# Altium schematic sheet main.SchDoc
size 209 x 297 mm; Address1: Address1; Address2: Address2; Address3: Address3; Address4: Address4; SheetNumber: 1; SheetTotal: 1; Scale: 1:1; Разраб.: М. Карг; Обозначение документа: epm3128.001 Э3; Пров.: макет; Утв.: ---; Номер листа: 1; Общее количество листов: 1; Наименование организации: Алгоритм; Перв. применение: epm.001; Наименование изделия 1: epm3128 extension; Наименование изделия 2: Схема электрическая; Наименование изделия 3: принципиальная; Нач. отд.: Нач. отд.; Фамилия нач. отд.: ---
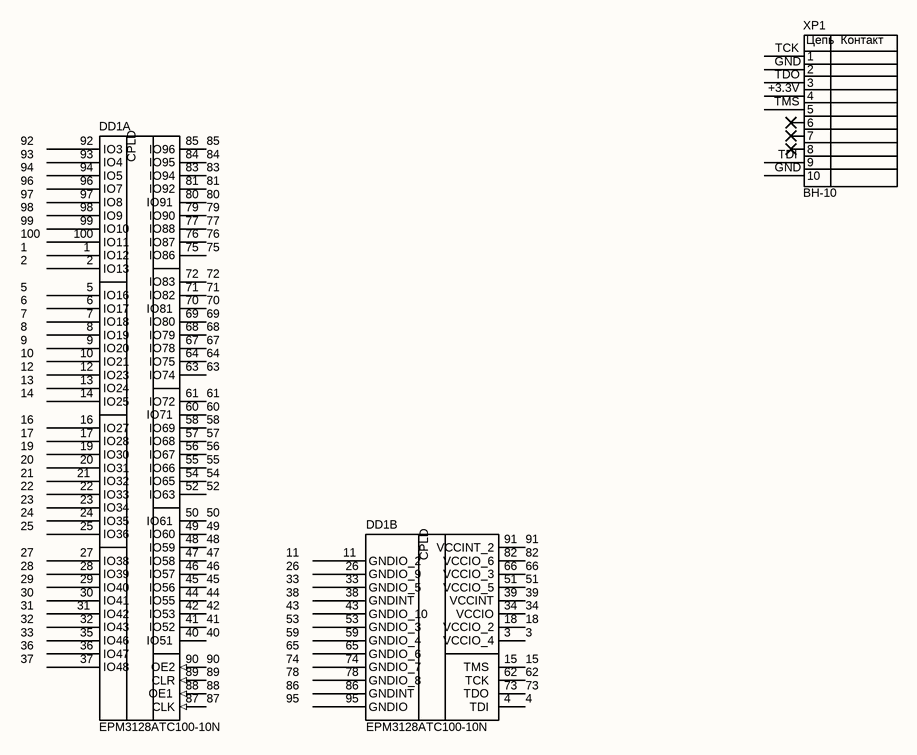
[diagram p0: main.SchDoc]

## Parts
(Parts that share a designator on the sheet are numbered #1, #2 ... from top to bottom, then left to right.)
1  onepin  [onepin]  (value not drawn)  (no BOM)
2  onepin  [onepin]  (value not drawn)  (no BOM)
3  onepin  [onepin]  (value not drawn)  (no BOM)
4  onepin  [onepin]  (value not drawn)  (no BOM)
5  onepin  [onepin]  (value not drawn)  (no BOM)
6  onepin  [onepin]  (value not drawn)  (no BOM)
7  onepin  [onepin]  (value not drawn)  (no BOM)
8  onepin  [onepin]  (value not drawn)  (no BOM)
9  onepin  [onepin]  (value not drawn)  (no BOM)
10  onepin  [onepin]  (value not drawn)  (no BOM)
11  onepin  [onepin]  (value not drawn)  (no BOM)
12  onepin  [onepin]  (value not drawn)  (no BOM)
13  onepin  [onepin]  (value not drawn)  (no BOM)
14  onepin  [onepin]  (value not drawn)  (no BOM)
15  onepin  [onepin]  (value not drawn)  (no BOM)
16  onepin  [onepin]  (value not drawn)  (no BOM)
17  onepin  [onepin]  (value not drawn)  (no BOM)
18  onepin  [onepin]  (value not drawn)  (no BOM)
19  onepin  [onepin]  (value not drawn)  (no BOM)
20  onepin  [onepin]  (value not drawn)  (no BOM)
21  onepin  [onepin]  (value not drawn)  (no BOM)
22  onepin  [onepin]  (value not drawn)  (no BOM)
23  onepin  [onepin]  (value not drawn)  (no BOM)
24  onepin  [onepin]  (value not drawn)  (no BOM)
25  onepin  [onepin]  (value not drawn)  (no BOM)
26  onepin  [onepin]  (value not drawn)  (no BOM)
27  onepin  [onepin]  (value not drawn)  (no BOM)
28  onepin  [onepin]  (value not drawn)  (no BOM)
29  onepin  [onepin]  (value not drawn)  (no BOM)
30  onepin  [onepin]  (value not drawn)  (no BOM)
31  onepin  [onepin]  (value not drawn)  (no BOM)
32  onepin  [onepin]  (value not drawn)  (no BOM)
33#1  onepin  [onepin]  (value not drawn)  (no BOM)
33#2  onepin  [onepin]  (value not drawn)  (no BOM)
34  onepin  [onepin]  (value not drawn)  (no BOM)
36  onepin  [onepin]  (value not drawn)  (no BOM)
37  onepin  [onepin]  (value not drawn)  (no BOM)
38  onepin  [onepin]  (value not drawn)  (no BOM)
39  onepin  [onepin]  (value not drawn)  (no BOM)
40  onepin  [onepin]  (value not drawn)  (no BOM)
41  onepin  [onepin]  (value not drawn)  (no BOM)
42  onepin  [onepin]  (value not drawn)  (no BOM)
43  onepin  [onepin]  (value not drawn)  (no BOM)
44  onepin  [onepin]  (value not drawn)  (no BOM)
45  onepin  [onepin]  (value not drawn)  (no BOM)
46  onepin  [onepin]  (value not drawn)  (no BOM)
47  onepin  [onepin]  (value not drawn)  (no BOM)
48  onepin  [onepin]  (value not drawn)  (no BOM)
49  onepin  [onepin]  (value not drawn)  (no BOM)
50  onepin  [onepin]  (value not drawn)  (no BOM)
51  onepin  [onepin]  (value not drawn)  (no BOM)
52  onepin  [onepin]  (value not drawn)  (no BOM)
53  onepin  [onepin]  (value not drawn)  (no BOM)
54  onepin  [onepin]  (value not drawn)  (no BOM)
55  onepin  [onepin]  (value not drawn)  (no BOM)
56  onepin  [onepin]  (value not drawn)  (no BOM)
57  onepin  [onepin]  (value not drawn)  (no BOM)
58  onepin  [onepin]  (value not drawn)  (no BOM)
59  onepin  [onepin]  (value not drawn)  (no BOM)
60  onepin  [onepin]  (value not drawn)  (no BOM)
61  onepin  [onepin]  (value not drawn)  (no BOM)
62  onepin  [onepin]  (value not drawn)  (no BOM)
63  onepin  [onepin]  (value not drawn)  (no BOM)
64  onepin  [onepin]  (value not drawn)  (no BOM)
65  onepin  [onepin]  (value not drawn)  (no BOM)
66  onepin  [onepin]  (value not drawn)  (no BOM)
67  onepin  [onepin]  (value not drawn)  (no BOM)
68  onepin  [onepin]  (value not drawn)  (no BOM)
69  onepin  [onepin]  (value not drawn)  (no BOM)
70  onepin  [onepin]  (value not drawn)  (no BOM)
71  onepin  [onepin]  (value not drawn)  (no BOM)
72  onepin  [onepin]  (value not drawn)  (no BOM)
73  onepin  [onepin]  (value not drawn)  (no BOM)
74  onepin  [onepin]  (value not drawn)  (no BOM)
75  onepin  [onepin]  (value not drawn)  (no BOM)
76  onepin  [onepin]  (value not drawn)  (no BOM)
77  onepin  [onepin]  (value not drawn)  (no BOM)
78  onepin  [onepin]  (value not drawn)  (no BOM)
79  onepin  [onepin]  (value not drawn)  (no BOM)
80  onepin  [onepin]  (value not drawn)  (no BOM)
81  onepin  [onepin]  (value not drawn)  (no BOM)
82  onepin  [onepin]  (value not drawn)  (no BOM)
83  onepin  [onepin]  (value not drawn)  (no BOM)
84  onepin  [onepin]  (value not drawn)  (no BOM)
85  onepin  [onepin]  (value not drawn)  (no BOM)
86  onepin  [onepin]  (value not drawn)  (no BOM)
87  onepin  [onepin]  (value not drawn)  (no BOM)
88  onepin  [onepin]  (value not drawn)  (no BOM)
89  onepin  [onepin]  (value not drawn)  (no BOM)
90  onepin  [onepin]  (value not drawn)  (no BOM)
91  onepin  [onepin]  (value not drawn)  (no BOM)
92  onepin  [onepin]  (value not drawn)  (no BOM)
93  onepin  [onepin]  (value not drawn)  (no BOM)
94  onepin  [onepin]  (value not drawn)  (no BOM)
95  onepin  [onepin]  (value not drawn)  (no BOM)
96  onepin  [onepin]  (value not drawn)  (no BOM)
97  onepin  [onepin]  (value not drawn)  (no BOM)
98  onepin  [onepin]  (value not drawn)  (no BOM)
99  onepin  [onepin]  (value not drawn)  (no BOM)
100  onepin  [onepin]  (value not drawn)  (no BOM)
DD1  EPM3128ATC100-10N  [QFP50P1600X1600X120-100N]  (parts A,B of 2)
XP1  BH-10  [BH-10]  (graphical)

## Nets
+3.3V: XP1.4
GND: XP1.2 XP1.10
TCK: XP1.1
TDI: XP1.9
TDO: XP1.3
TMS: XP1.5
Net1_1: 1.1 DD1.1(IO12)
Net2_1: 2.1 DD1.2(IO13)
Net3_1: 3.1 DD1.3(VCCIO_4)
Net4_1: 4.1 DD1.4(TDI)
Net5_1: 5.1 DD1.5(IO16)
Net6_1: 6.1 DD1.6(IO17)
Net7_1: 7.1 DD1.7(IO18)
Net8_1: 8.1 DD1.8(IO19)
Net9_1: 9.1 DD1.9(IO20)
Net10_1: 10.1 DD1.10(IO21)
Net11_1: 11.1 DD1.11(GNDIO_2)
Net12_1: 12.1 DD1.12(IO23)
Net13_1: 13.1 DD1.13(IO24)
Net14_1: 14.1 DD1.14(IO25)
Net15_1: 15.1 DD1.15(TMS)
Net16_1: 16.1 DD1.16(IO27)
Net17_1: 17.1 DD1.17(IO28)
Net18_1: 18.1 DD1.18(VCCIO_2)
Net19_1: 19.1 DD1.19(IO30)
Net20_1: 20.1 DD1.20(IO31)
Net21_1: 21.1 DD1.21(IO32)
Net22_1: 22.1 DD1.22(IO33)
Net23_1: 23.1 DD1.23(IO34)
Net24_1: 24.1 DD1.24(IO35)
Net25_1: 25.1 DD1.25(IO36)
Net26_1: 26.1 DD1.26(GNDIO_9)
Net27_1: 27.1 DD1.27(IO38)
Net28_1: 28.1 DD1.28(IO39)
Net29_1: 29.1 DD1.29(IO40)
Net30_1: 30.1 DD1.30(IO41)
Net31_1: 31.1 DD1.31(IO42)
Net32_1: 32.1 DD1.32(IO43)
Net33#1_1: 33#1.1 DD1.33(GNDIO_5)
Net33#2_1: 33#2.1 DD1.35(IO46)
Net34_1: 34.1 DD1.34(VCCIO)
Net36_1: 36.1 DD1.36(IO47)
Net37_1: 37.1 DD1.37(IO48)
Net38_1: 38.1 DD1.38(GNDINT)
Net39_1: 39.1 DD1.39(VCCINT)
Net40_1: 40.1 DD1.40(IO51)
Net41_1: 41.1 DD1.41(IO52)
Net42_1: 42.1 DD1.42(IO53)
Net43_1: 43.1 DD1.43(GNDIO_10)
Net44_1: 44.1 DD1.44(IO55)
Net45_1: 45.1 DD1.45(IO56)
Net46_1: 46.1 DD1.46(IO57)
Net47_1: 47.1 DD1.47(IO58)
Net48_1: 48.1 DD1.48(IO59)
Net49_1: 49.1 DD1.49(IO60)
Net50_1: 50.1 DD1.50(IO61)
Net51_1: 51.1 DD1.51(VCCIO_5)
Net52_1: 52.1 DD1.52(IO63)
Net53_1: 53.1 DD1.53(GNDIO_3)
Net54_1: 54.1 DD1.54(IO65)
Net55_1: 55.1 DD1.55(IO66)
Net56_1: 56.1 DD1.56(IO67)
Net57_1: 57.1 DD1.57(IO68)
Net58_1: 58.1 DD1.58(IO69)
Net59_1: 59.1 DD1.59(GNDIO_4)
Net60_1: 60.1 DD1.60(IO71)
Net61_1: 61.1 DD1.61(IO72)
Net62_1: 62.1 DD1.62(TCK)
Net63_1: 63.1 DD1.63(IO74)
Net64_1: 64.1 DD1.64(IO75)
Net65_1: 65.1 DD1.65(GNDIO_6)
Net66_1: 66.1 DD1.66(VCCIO_3)
Net67_1: 67.1 DD1.67(IO78)
Net68_1: 68.1 DD1.68(IO79)
Net69_1: 69.1 DD1.69(IO80)
Net70_1: 70.1 DD1.70(IO81)
Net71_1: 71.1 DD1.71(IO82)
Net72_1: 72.1 DD1.72(IO83)
Net73_1: 73.1 DD1.73(TDO)
Net74_1: 74.1 DD1.74(GNDIO_7)
Net75_1: 75.1 DD1.75(IO86)
Net76_1: 76.1 DD1.76(IO87)
Net77_1: 77.1 DD1.77(IO88)
Net78_1: 78.1 DD1.78(GNDIO_8)
Net79_1: 79.1 DD1.79(IO90)
Net80_1: 80.1 DD1.80(IO91)
Net81_1: 81.1 DD1.81(IO92)
Net82_1: 82.1 DD1.82(VCCIO_6)
Net83_1: 83.1 DD1.83(IO94)
Net84_1: 84.1 DD1.84(IO95)
Net85_1: 85.1 DD1.85(IO96)
Net86_1: 86.1 DD1.86(GNDINT)
Net87_1: 87.1 DD1.87(CLK)
Net88_1: 88.1 DD1.88(OE1)
Net89_1: 89.1 DD1.89(CLR)
Net90_1: 90.1 DD1.90(OE2)
Net91_1: 91.1 DD1.91(VCCINT_2)
Net92_1: 92.1 DD1.92(IO3)
Net93_1: 93.1 DD1.93(IO4)
Net94_1: 94.1 DD1.94(IO5)
Net95_1: 95.1 DD1.95(GNDIO)
Net96_1: 96.1 DD1.96(IO7)
Net97_1: 97.1 DD1.97(IO8)
Net98_1: 98.1 DD1.98(IO9)
Net99_1: 99.1 DD1.99(IO10)
Net100_1: 100.1 DD1.100(IO11)

Not connected (* = marked no-connect by the designer): XP1 6* 7* 8*

## Notes on the sheet
- Перв. примен.
- Справ. №
- Подп. и дата
- Инв. № дубл.
- Взам. инв. №
- Разраб.
- Изм.
- Лист
- № докум.
- Подп.
- Дата
- Лит.
- Масса
- Масштаб
- Пров.
- Т.контр.
- Листов
- Инв. № подл.
- Утв.
- Н.контр.
- Копировал
- Формат А4
- (in symbol BH-10) Цепь; Контакт
- (in symbol EPM3128ATC100-10N, part A) CPLD
- (in symbol EPM3128ATC100-10N, part B) CPLD

## Library data of the parts
DD1 = EPM3128ATC100-10N: 100-Pin QFP; Package: None; Price: None; Value: *; MP: EPM3128ATC100-10N; Availability: Unavailable
XP1 = BH-10: 10 Position Total Dual Row 2.54 mm Pitch Straight Male Shrouded Box Header; MF: Sullins Connector; MP: SBH11-PBPC-D05-ST-BK; SnapEDA_Link: https://www.snapeda.com/parts/SBH11-PBPC-D05-ST-BK/Sullins+Connector+Solutions/view-part/?ref=snap; Package: None; Value: *; Check_prices: https://www.snapeda.com/parts/SBH11-PBPC-D05-ST-BK/Sullins+Connector+Solutions/view-part/?ref=eda